# Altium schematic sheet Control_Unit.SchDoc: Control Unit
size A4; CompanyName: SpaceBee Technologies; Organization: Open Space; Address1: Argentina; DocumentNumber: 1; Revision: 0; SheetNumber: 2; SheetTotal: 6; Proyect: Rovertito; Mail: mgmt@spacebeetech.com
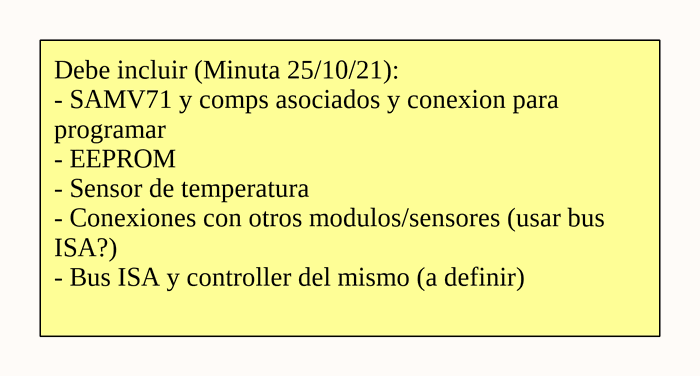
[diagram p0: Control_Unit.SchDoc]

## Notes on the sheet
- Debe incluir (Minuta 25/10/21):
  - SAMV71 y comps asociados y conexion para programar
  - EEPROM
  - Sensor de temperatura
  - Conexiones con otros modulos/sensores (usar bus ISA?)
  - Bus ISA y controller del mismo (a definir)
- Title
- Board:
- File:
- Authors
- M. Armanasco
- S. Nuñez
- M. Vagalao
- Proyect:
- Date:
- Mail:
- Size:
- Sheet
- A4
- of
- Organization:
- Revision:
- S. Rodriguez
- S. Leguizamon
- J. Alvarez
- and